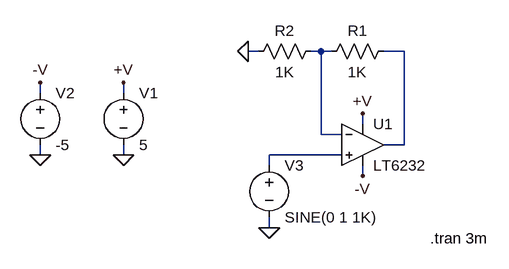
[diagram p0: schematic 6232.asc]
6232.asc, the LTspice schematic file:
Version 4
SHEET 1 896 680
WIRE -80 96 -96 96
WIRE 16 96 0 96
WIRE 32 96 16 96
WIRE 144 96 112 96
WIRE -416 160 -416 144
WIRE -288 160 -288 144
WIRE 80 208 80 192
WIRE 16 224 16 96
WIRE 48 224 16 224
WIRE 144 240 144 96
WIRE 144 240 112 240
WIRE -416 256 -416 240
WIRE -288 256 -288 240
WIRE 48 256 -64 256
WIRE -64 272 -64 256
WIRE 80 288 80 272
WIRE -64 368 -64 352
FLAG -288 256 0
FLAG 80 192 +V
FLAG -288 144 +V
FLAG 80 288 -V
FLAG -416 256 0
FLAG -416 144 -V
FLAG -96 96 0
FLAG -64 368 0
SYMBOL voltage -288 144 R0
SYMATTR InstName V1
SYMATTR Value 5
SYMBOL voltage -416 144 R0
SYMATTR InstName V2
SYMATTR Value -5
SYMBOL res 128 80 R90
WINDOW 0 0 56 VBottom 2
WINDOW 3 32 56 VTop 2
SYMATTR InstName R1
SYMATTR Value 1K
SYMBOL res 16 80 R90
WINDOW 0 0 56 VBottom 2
WINDOW 3 32 56 VTop 2
SYMATTR InstName R2
SYMATTR Value 1K
SYMBOL voltage -64 256 R0
SYMATTR InstName V3
SYMATTR Value SINE(0 1 1K)
SYMBOL opamps\\LT6232 80 240 R0
SYMATTR InstName U1
TEXT 184 384 Left 2 !.tran 3m

The netlist it stands for:
* 6232.asc
V1 +V 0 5
V2 -V 0 -5
R1 N002 N001 1K
R2 N001 0 1K
V3 N003 0 SINE(0 1 1K)
* U1: LT6232 (symbol opamps\LT6232 not available, pins judged from their places): In+=N003 In-=N001 V+=+V V-=-V OUT=N002
.tran 3m
.backanno
.end